# Altium schematic sheet Board.SchDoc
size A4; SheetNumber: 1; SheetTotal: 4
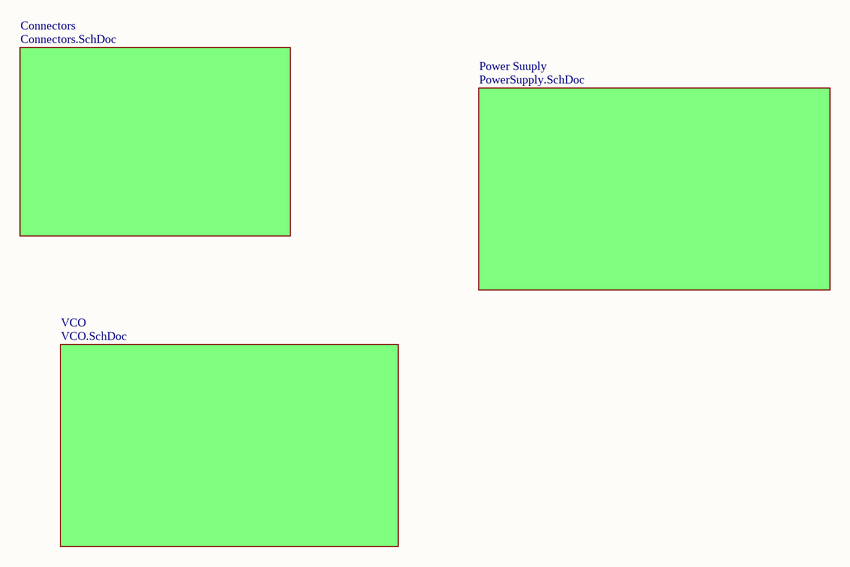
[diagram p0: Board.SchDoc]

## Sub-sheets
Connectors = Connectors.SchDoc: no entries
Power Suuply = PowerSupply.SchDoc: no entries
VCO = VCO.SchDoc: no entries